# EAGLE schematic daughter-pots (EAGLE 6.6.0)
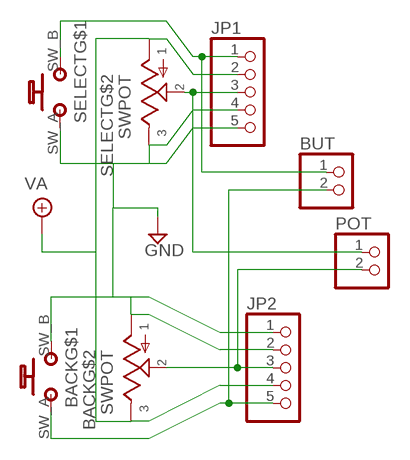
[diagram p0: schematic, sheet 1]

## Parts
BACK  SWPOT  [SWPOT]
BUT  PINHD-1X2  [1X02]
JP1  PINHD-1X5  [1X05]
JP2  PINHD-1X5  [1X05]
POT  PINHD-1X2  [1X02]
SELECT  SWPOT  [SWPOT]

## Nets
GND: BACK.POT_B BACK.SW_B(B_B) JP1.4 JP1.5 JP2.1 JP2.2 SELECT.POT_A SELECT.SW_A(B_A)
N$2: JP1.3 POT.1 SELECT.POT_W
N$3: BACK.POT_W JP2.3 POT.2
N$5: BUT.1 JP1.1 SELECT.SW_B(B_B)
N$11: BACK.SW_A(B_A) BUT.2 JP2.5
VA: BACK.POT_A JP1.2 JP2.4 SELECT.POT_B

## Library data of the parts
BACK SELECT = jaapie:SWPOT
BUT POT = pinhead:PINHD-1X2: PIN HEADER
JP1 JP2 = pinhead:PINHD-1X5: PIN HEADER